# EAGLE design dual.vca.main (EAGLE 7.5.0)
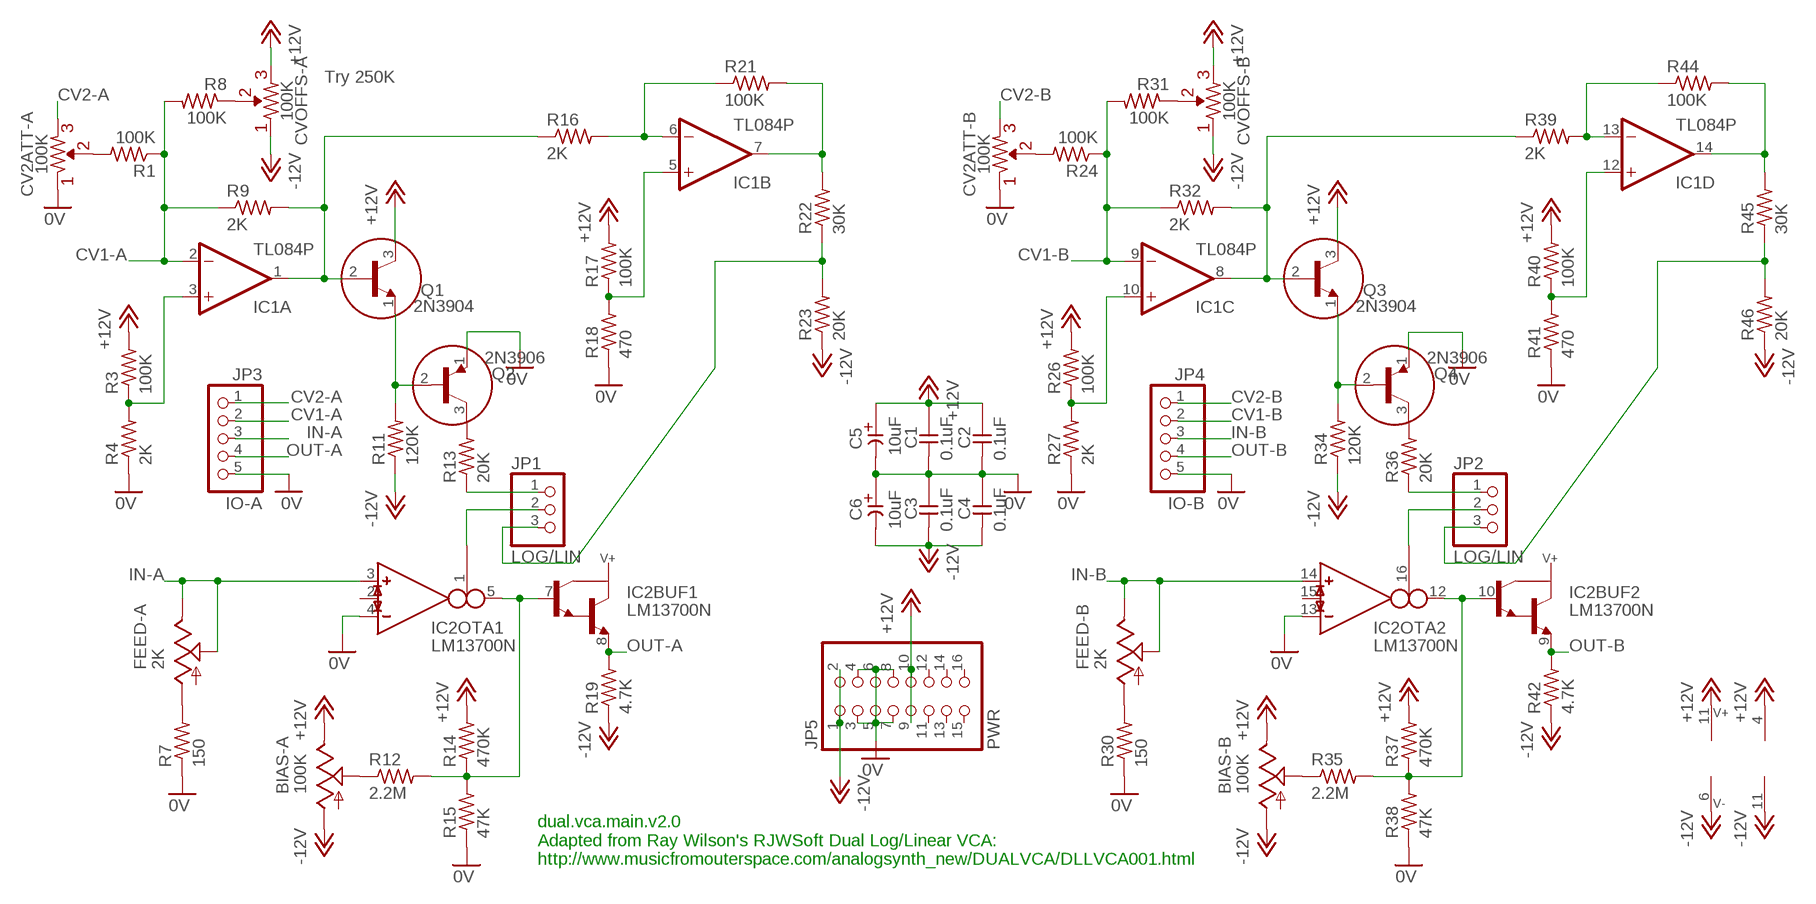
[diagram p0: schematic, sheet 1]

## Parts
BIAS-A  100K  TRIM_US-PT10S  [PT-10S]
BIAS-B  100K  TRIM_US-PT10S  [PT-10S]
C1  0.1uF  CC-US025-024X044  [C025-024X044]
C2  0.1uF  CC-US025-024X044  [C025-024X044]
C3  0.1uF  CC-US025-024X044  [C025-024X044]
C4  0.1uF  CC-US025-024X044  [C025-024X044]
C5  10uF  CE-USE2-5  [E2-5]
C6  10uF  CE-USE2-5  [E2-5]
CV2ATT-A  100K  R-VAR  [R-VAR]
CV2ATT-B  100K  R-VAR  [R-VAR]
CVOFFS-A  100K  R-VAR  [R-VAR]
CVOFFS-B  100K  R-VAR  [R-VAR]
FEED-A  2K  TRIM_US-PT10S  [PT-10S]
FEED-B  2K  TRIM_US-PT10S  [PT-10S]
IC1  TL084P  [DIL14]
IC2  LM13700N  [DIL16]
JP1  LOG/LIN  PINHD-1X3  [1X03]
JP2  LOG/LIN  PINHD-1X3  [1X03]
JP3  IO-A  PINHD-1X5  [1X05]
JP4  IO-B  PINHD-1X5  [1X05]
JP5  PWR  PINHD-2X8  [2X08]
Q1  2N3904  [TO92]
Q2  2N3906  [TO92]
Q3  2N3904  [TO92]
Q4  2N3906  [TO92]
R1  100K  R-US_0207/7  [0207/7]
R3  100K  R-US_0207/7  [0207/7]
R4  2K  R-US_0207/7  [0207/7]
R7  150  R-US_0207/7  [0207/7]
R8  100K  R-US_0207/7  [0207/7]
R9  2K  R-US_0207/7  [0207/7]
R11  120K  R-US_0207/7  [0207/7]
R12  2.2M  R-US_0207/7  [0207/7]
R13  20K  R-US_0207/7  [0207/7]
R14  470K  R-US_0207/7  [0207/7]
R15  47K  R-US_0207/7  [0207/7]
R16  2K  R-US_0207/7  [0207/7]
R17  100K  R-US_0207/7  [0207/7]
R18  470  R-US_0207/7  [0207/7]
R19  4.7K  R-US_0207/7  [0207/7]
R21  100K  R-US_0207/7  [0207/7]
R22  30K  R-US_0207/7  [0207/7]
R23  20K  R-US_0207/7  [0207/7]
R24  100K  R-US_0207/7  [0207/7]
R26  100K  R-US_0207/7  [0207/7]
R27  2K  R-US_0207/7  [0207/7]
R30  150  R-US_0207/7  [0207/7]
R31  100K  R-US_0207/7  [0207/7]
R32  2K  R-US_0207/7  [0207/7]
R34  120K  R-US_0207/7  [0207/7]
R35  2.2M  R-US_0207/7  [0207/7]
R36  20K  R-US_0207/7  [0207/7]
R37  470K  R-US_0207/7  [0207/7]
R38  47K  R-US_0207/7  [0207/7]
R39  2K  R-US_0207/7  [0207/7]
R40  100K  R-US_0207/7  [0207/7]
R41  470  R-US_0207/7  [0207/7]
R42  4.7K  R-US_0207/7  [0207/7]
R44  100K  R-US_0207/7  [0207/7]
R45  30K  R-US_0207/7  [0207/7]
R46  20K  R-US_0207/7  [0207/7]

## Nets
0V: C1.2 C2.2 C3.1 C4.1 C5.- C6.+ CV2ATT-A.R1 CV2ATT-B.R1 IC2.4(OTA1:IN_N) IC2.13(OTA2:IN_N) JP3.5 JP4.5 JP5.3 JP5.4 JP5.5 JP5.6 JP5.7 JP5.8 Q2.1(E) Q4.1(E) R4.1 R7.1 R15.1 R18.1 R27.1 R30.1 R38.1 R41.1
+12V: BIAS-A.E BIAS-B.E C1.1 C2.1 C5.+ CVOFFS-A.R2 CVOFFS-B.R2 IC1.4(P:V+) IC2.11(SUPPLY:V+) JP5.9 JP5.10 Q1.3(C) Q3.3(C) R3.2 R14.2 R17.2 R26.2 R37.2 R40.2
-12V: BIAS-A.A BIAS-B.A C3.2 C4.2 C6.- CVOFFS-A.R1 CVOFFS-B.R1 IC1.11(P:V-) IC2.6(SUPPLY:V-) JP5.1 JP5.2 R11.1 R19.1 R23.1 R34.1 R42.1 R46.1
CV1-A: IC1.2(A:-IN) JP3.2 R1.1 R8.2 R9.1
CV1-B: IC1.9(C:-IN) JP4.2 R24.1 R31.2 R32.1
CV2-A: CV2ATT-A.R2 JP3.1
CV2-B: CV2ATT-B.R2 JP4.1
IN-A: FEED-A.E FEED-A.S IC2.3(OTA1:IN_P) JP3.3
IN-B: FEED-B.E FEED-B.S IC2.14(OTA2:IN_P) JP4.3
N$1: Q2.3(C) R13.2
N$2: Q4.3(C) R36.2
N$3: IC1.3(A:+IN) R3.1 R4.2
N$5: CVOFFS-A.VAR R8.1
N$6: IC1.1(A:OUT) Q1.2(B) R9.2 R16.1
N$7: Q1.1(E) Q2.2(B) R11.2
N$8: FEED-A.A R7.2
N$10: JP1.1 R13.1
N$14: BIAS-A.S R12.1
N$15: IC2.5(OTA1:OUT) IC2.7(BUF1:B) R12.2 R14.1 R15.2
N$17: CV2ATT-A.VAR R1.2
N$18: JP1.3 R22.1 R23.2
N$19: IC1.5(B:+IN) R17.1 R18.2
N$20: IC1.6(B:-IN) R16.2 R21.1
N$21: IC2.1(OTA1:I_BIAS) JP1.2
N$22: IC1.7(B:OUT) R21.2 R22.2
N$25: IC1.10(C:+IN) R26.1 R27.2
N$27: CVOFFS-B.VAR R31.1
N$28: IC1.8(C:OUT) Q3.2(B) R32.2 R39.1
N$29: Q3.1(E) Q4.2(B) R34.2
N$31: FEED-B.A R30.2
N$34: BIAS-B.S R35.1
N$35: IC2.10(BUF2:B) IC2.12(OTA2:OUT) R35.2 R37.1 R38.2
N$38: CV2ATT-B.VAR R24.2
N$39: IC1.12(D:+IN) R40.1 R41.2
N$40: IC1.13(D:-IN) R39.2 R44.1
N$41: IC1.14(D:OUT) R44.2 R45.2
N$42: JP2.1 R36.1
N$43: JP2.3 R45.1 R46.2
N$44: IC2.16(OTA2:I_BIAS) JP2.2
OUT-A: IC2.8(BUF1:E) JP3.4 R19.2
OUT-B: IC2.9(BUF2:E) JP4.4 R42.2
Unconnected: IC2.2(OTA1:I_DIODE) IC2.15(OTA2:I_DIODE) JP5.11 JP5.12 JP5.13 JP5.14 JP5.15 JP5.16

## Notes on the sheet
- Try 250K
- dual.vca.main.v2.0
  Adapted from Ray Wilson's RJWSoft Dual Log/Linear VCA:
  http://www.musicfromouterspace.com/analogsynth_new/DUALVCA/DLLVCA001.html

## Library data of the parts
BIAS-A BIAS-B FEED-A FEED-B = pot:TRIM_US-: POTENTIOMETER
C1-C4 = _common:CC-US: CAPACITOR, US symbol
C5 C6 = _common:CE-US: ELECTROLYTIC CAPACITOR, US symbol
CV2ATT-A CV2ATT-B CVOFFS-A CVOFFS-B = _common:R-VAR
IC1 = linear:TL084: OP AMP
IC2 = ota:LM13700: Dual OTA with buffers
JP1 JP2 = pinhead:PINHD-1X3: PIN HEADER
JP3 JP4 = pinhead:PINHD-1X5: PIN HEADER
JP5 = pinhead:PINHD-2X8: PIN HEADER
Q1 Q3 = _common:2N3904
Q2 Q4 = _common:2N3906: PNP Transistor
R1 R3 R4 R7-R9 R11-R19 R21-R24 R26 R27 R30-R32 R34-R42 R44-R46 = resistor:R-US_: RESISTOR, American symbol

## Board
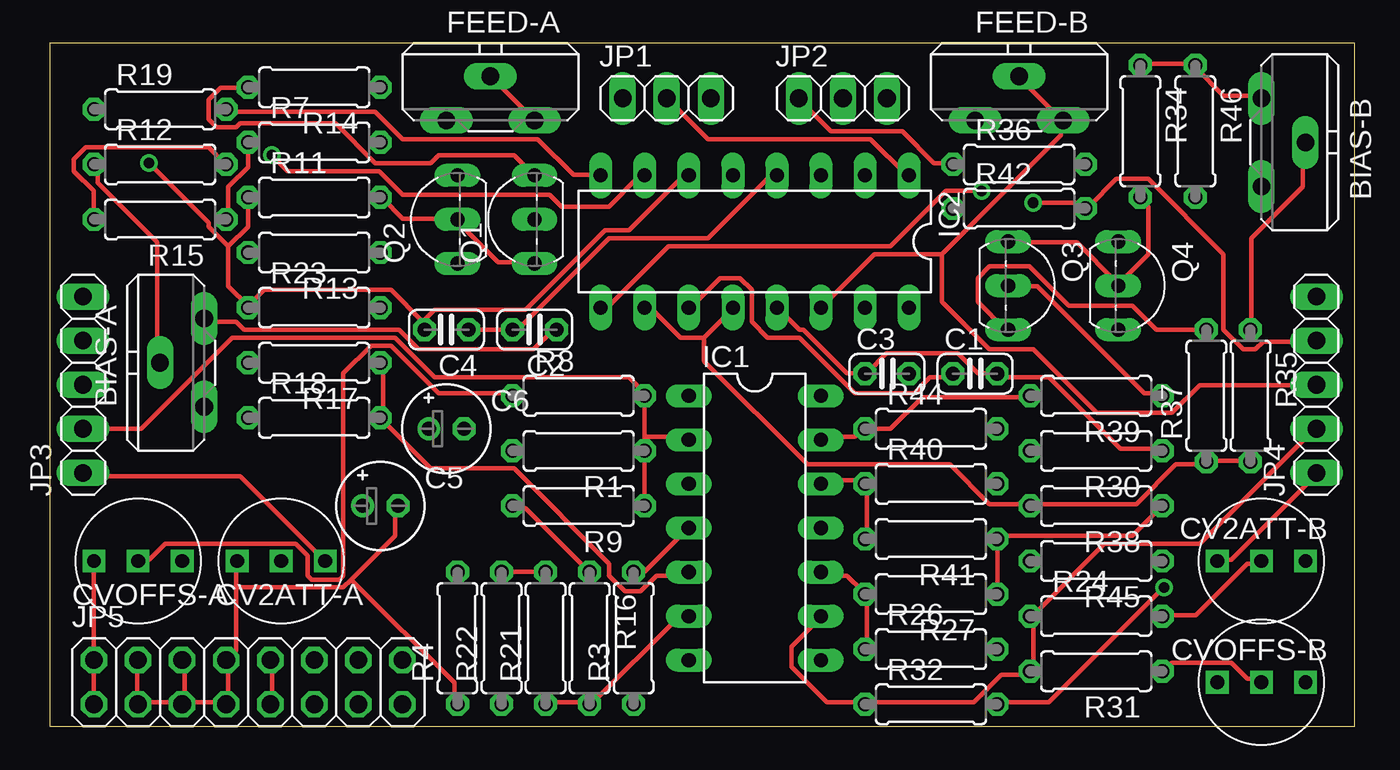
[diagram p1: board, top side]
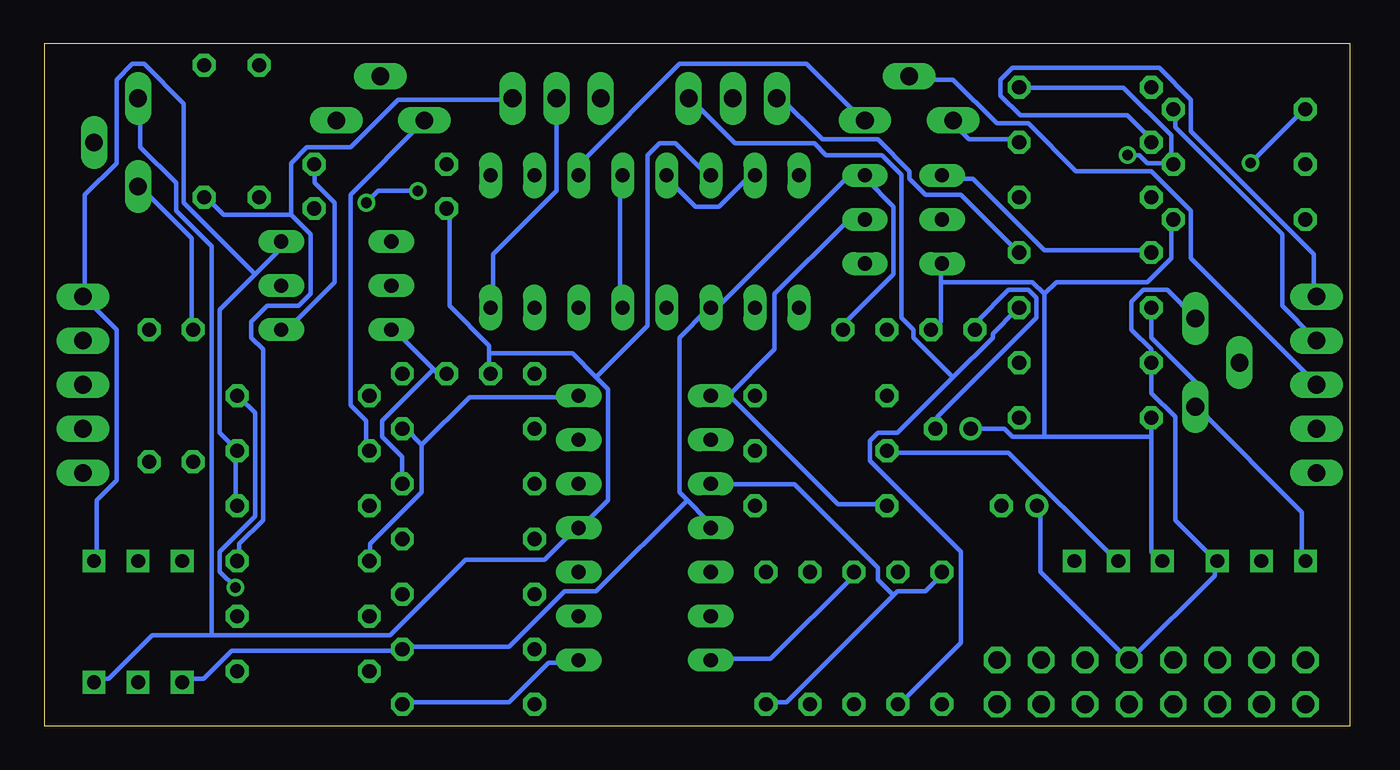
[diagram p2: board, bottom side, seen from below]

Size 75.23 x 39.36 mm. Coordinates in mm from the lower left corner, seen from the top.
Outline: 0,0 75.23,0 75.23,39.36 0,39.36 0,0
Copper layers (1*16): Top 0.035mm / dielectric 1.5mm / Bottom 0.035mm
Design rules "default": minimum track width 10mil, minimum drill 24mil, track to track 8mil, track to pad 8mil, pad to pad 8mil, via to via 8mil, smd to smd 8mil, copper to edge 40mil, drill to drill 8mil, minimum pad ring 10mil, minimum via ring 8mil, stop-mask expansion 4mil, vias tented up to drill 0mil, thermal gap 10mil

### Footprints (pad centres in the part's own frame; a part is rotated, then mirrored left to right if it is on the bottom)
PT-10S = drill 1.016 long: A -2.54,-1.27; E 2.54,-1.27; S 0,1.27
C025-024X044 = drill 0.813 octagon: 1 -1.27,0; 2 1.27,0
E2-5 = drill 0.813 pad 1.27: + -1.016,0 | drill 0.813 pad 1.27 octagon: - 1.016,0
R-VAR = drill 0.8 square: R1 -2.54,0; R2 2.54,0; VAR 0,0
DIL14 = drill 0.813 long: 1 -7.62,-3.81; 2 -5.08,-3.81; 3 -2.54,-3.81; 4 0,-3.81; 5 2.54,-3.81; 6 5.08,-3.81; 7 7.62,-3.81; 8 7.62,3.81; 9 5.08,3.81; 10 2.54,3.81; 11 0,3.81; 12 -2.54,3.81; 13 -5.08,3.81; 14 -7.62,3.81
DIL16 = drill 0.813 long: 1 -8.89,-3.81; 2 -6.35,-3.81; 3 -3.81,-3.81; 4 -1.27,-3.81; 5 1.27,-3.81; 6 3.81,-3.81; 7 6.35,-3.81; 8 8.89,-3.81; 9 8.89,3.81; 10 6.35,3.81; 11 3.81,3.81; 12 1.27,3.81; 13 -1.27,3.81; 14 -3.81,3.81; 15 -6.35,3.81; 16 -8.89,3.81
1X03 = drill 1.016 long: 1 -2.54,0; 2 0,0; 3 2.54,0
1X05 = drill 1.016 long: 1 -5.08,0; 2 -2.54,0; 3 0,0; 4 2.54,0; 5 5.08,0
2X08 = drill 1.016 octagon: 1 -8.89,-1.27; 2 -8.89,1.27; 3 -6.35,-1.27; 4 -6.35,1.27; 5 -3.81,-1.27; 6 -3.81,1.27; 7 -1.27,-1.27; 8 -1.27,1.27; 9 1.27,-1.27; 10 1.27,1.27; 11 3.81,-1.27; 12 3.81,1.27; 13 6.35,-1.27; 14 6.35,1.27; 15 8.89,-1.27; 16 8.89,1.27
TO92 = drill 0.813 long: 1 -2.54,-1.27; 2 0,-1.27; 3 2.54,-1.27
0207/7 = drill 0.813 octagon: 1 -3.81,0; 2 3.81,0

### Placement (x,y rotation side)
BIAS-A  7.62,20.95 90 top
BIAS-B  71.12,33.66 270 top
C1  53.34,20.32 0 top
C2  27.94,22.86 180 top
C3  48.26,20.32 0 top
C4  22.86,22.86 180 top
C5  19.05,12.7 0 top
C6  22.86,17.14 0 top
CV2ATT-A  13.34,9.53 0 top
CV2ATT-B  69.85,9.53 180 top
CVOFFS-A  5.08,9.53 0 top
CVOFFS-B  69.85,2.54 180 top
FEED-A  25.4,36.2 0 top
FEED-B  55.88,36.2 0 top
IC1  40.64,11.43 270 top
IC2  40.64,27.94 180 top
JP1  35.56,36.2 0 top
JP2  45.72,36.2 0 top
JP3  1.91,19.68 90 top
JP4  73.03,19.68 90 top
JP5  11.43,2.54 0 top
Q1  26.67,29.21 90 top
Q2  22.23,29.21 90 top
Q3  56.52,25.4 270 top
Q4  62.87,25.4 270 top
R1  30.48,15.88 180 top
R3  33.66,5.08 90 top
R4  23.5,5.08 90 top
R7  15.24,33.66 0 top
R8  30.48,19.05 0 top
R9  30.48,12.7 180 top
R11  15.24,30.48 0 top
R12  6.35,32.38 0 top
R13  15.24,27.3 180 top
R14  15.24,36.83 180 top
R15  6.35,29.21 180 top
R16  31.11,5.08 270 top
R17  15.24,20.95 180 top
R18  15.24,17.78 0 top
R19  6.35,35.56 0 top
R21  28.57,5.08 90 top
R22  26.04,5.08 90 top
R23  15.24,24.13 0 top
R24  60.33,6.35 0 top
R26  50.8,4.45 0 top
R27  50.8,7.62 180 top
R30  60.33,15.88 180 top
R31  60.33,3.17 180 top
R32  50.8,1.27 0 top
R34  62.87,34.29 270 top
R35  69.22,19.05 270 top
R36  55.88,32.38 0 top
R37  66.67,19.05 90 top
R38  60.33,12.7 180 top
R39  60.33,19.05 180 top
R40  50.8,13.97 0 top
R41  50.8,10.79 180 top
R42  55.88,29.84 0 top
R44  50.8,17.14 0 top
R45  60.33,9.53 180 top
R46  66.04,34.29 270 top

### Tracks (layer width: path | path; a pad name or v marks a point on that pad's centre or on a via)
0V
  Top 0.254: IC2.13 42.06,24 43.2,22.86 43.43,22.86 45.95,20.34 46.86,20.34 C3.1 47.09,20.34 48.23,21.49 52.35,21.49 53.49,20.34 54.41,20.34 C1.2 54.63,20.12 57.61,20.12 61.72,16 64.01,16 R30.1 | R27.1 54.63,7.77 54.63,10.74 R41.1 54.63,10.97 62.41,10.97 R38.1 | R7.1 11.43,32.23 10.29,31.09 10.29,29.26 R15.1 | C4.1 C2.2 26.98,22.86 32.23,28.12 37.95,28.12 41.38,31.55 41.83,31.55 IC2.4 | JP5.4 5.03,3.66 5.03,1.37 JP5.3 5.26,1.37 7.54,1.37 JP5.5 7.77,1.37 | 7.77,1.37 7.77,3.66 JP5.6 | 10.74,8 10.74,4.34 10.29,3.89 JP5.8 10.29,3.66 10.29,1.37 JP5.7 10.06,1.37 7.77,1.37 | 10.74,8 10.74,9.37 CV2ATT-A.R1 | 17.37,8.46 16.92,8 10.74,8 | 17.37,8.46 19.89,10.97 19.89,12.57 C5.- | 17.37,8.46 23.32,2.52 23.32,1.37 R4.1
  Bottom 0.254: IC2.4 42.06,31.55 42.06,24.23 IC2.13 | CV2ATT-B.R1 72.24,9.6 72.24,13.03 71.09,14.17 71.09,22.86 72.92,24.69 JP4.5 72.92,24.92 72.92,30.63 71.09,32.46 71.09,37.26 70.18,38.18 69.49,38.18 67.21,35.89 67.21,30.18 63.09,26.06 | R38.1 64.24,12.8 64.24,15.77 R30.1 64.24,16 65.15,16.92 65.15,24 63.09,26.06 | 63.09,26.06 61.72,27.43 61.72,27.89 Q4.1 | JP3.5 2.06,24.92 2.06,27.2 9.14,34.29 9.14,36.12 10.97,37.95 19.43,37.95 20.12,37.26 20.12,36.35 18.97,35.2 12.8,35.2 11.43,33.83 R7.1 | 23.55,25.6 23.55,23.32 24,22.86 C4.1 | 23.55,25.6 23.55,26.52 Q2.1 | 11.43,16.69 11.43,10.06 10.97,9.6 CV2ATT-A.R1 | 11.43,16.69 R18.1 | C6.+ 19.89,17.14 19.43,16.69 17.6,16.69 | 11.43,16.69 17.6,16.69 | 23.55,25.6 18.29,25.6 17.6,24.92 | 17.6,16.69 17.6,24.92 | 17.6,24.92 16.92,25.6 11.66,25.6 10.29,26.98 10.29,29.03 R15.1
+12V
  Top 0.254: R37.2 63.78,22.86 62.41,24.23 58.75,24.23 56.46,26.52 54.18,26.52 53.49,25.83 53.49,24.46 55.09,22.86 Q3.3 | JP5.9 12.8,1.37 12.8,3.66 JP5.10 | R3.2 33.83,8.91 34.29,8.91 36.8,11.43 IC1.4 | R14.2 11.43,36.8 9.83,36.8 9.14,36.12 9.14,34.98 9.6,34.52 10.74,34.52 10.97,34.75 16.46,34.75 18.75,32.46 21.95,32.46 22.4,32.92 26.75,32.92 27.89,31.77 Q1.3 | BIAS-A.E 8.91,23.32 10.74,23.32 11.2,22.86 20.12,22.86 21.26,21.72 27.89,21.72 29.03,22.86 C2.1 | C1.1 51.89,20.12 50.75,20.12 49.84,19.2 46.41,19.2 43.2,22.4 41.38,22.4 40.46,23.32 40.46,25.15 39.78,25.83 38.63,25.83 37.03,24.23 IC2.11
  Bottom 0.254: R37.2 66.75,22.86 66.75,28.12 69.72,31.09 BIAS-B.E | 52.81,20.57 55.09,22.86 Q3.3 | 52.81,20.57 52.58,20.34 52.12,20.34 C1.1 | 52.81,20.57 55.78,17.6 55.78,16.69 54.63,15.54 54.63,14.17 R40.2 | BIAS-A.E 8.91,23.55 10.52,25.15 11.89,25.15 12.57,24.46 12.57,22.86 11.43,21.72 R17.2 11.43,19.2 10.06,17.83 10.06,11.89 7.77,9.6 CVOFFS-A.R2 7.77,9.37 7.77,8.69 12.57,3.89 JP5.10 12.8,3.89 17.83,8.91 17.83,12.57 C5.+ | CVOFFS-B.R2 67.21,2.74 66.06,2.74 64.47,4.34 54.63,4.34 R26.2 54.41,4.57 48.46,4.57 45.26,7.77 43.43,7.77 38.18,13.03 | C2.1 29.03,22.86 29.03,23.32 26.29,26.06 26.29,29.95 27.89,31.55 Q1.3 28.12,31.55 29.03,31.55 36.35,24.23 36.8,24.23 IC2.11 37.03,24 38.63,22.4 38.63,13.49 38.18,13.03 | 38.18,13.03 37.03,11.89 37.03,11.43 IC1.4
-12V  (via drill 0.61)
  Top 0.254: R34.1 62.87,38.18 65.84,38.18 R46.1 66.06,37.95 67.67,36.35 69.72,36.35 BIAS-B.A | CVOFFS-A.R1 2.52,9.37 2.52,3.89 JP5.2 2.52,3.66 2.52,1.37 JP5.1 | R11.1 11.43,28.8 10.29,27.66 | 10.29,27.66 10.29,25.38 11.43,24.23 | v5.71,32.46 9.14,29.03 9.14,28.8 10.29,27.66 | 21.49,23.32 21.49,22.86 C4.2 21.49,23.32 | 21.49,23.32 19.66,25.15 12.34,25.15 11.43,24.23 | 11.43,24.23 R23.1 | 21.49,23.32 22.17,24 27.43,24 32,28.57 33.38,28.57 36.35,31.55 36.8,31.55 IC2.6
  Bottom 0.254: 49.61,21.49 49.61,21.95 51.89,24.23 51.89,29.72 R42.1 | 49.61,21.49 49.61,20.34 C3.2 | 65.61,5.26 55.32,5.26 50.98,9.6 46.41,9.6 44.58,11.43 IC1.11 44.35,11.43 42.75,13.03 42.75,19.43 43.43,20.12 | 65.61,5.26 69.04,5.26 71.55,2.74 72.24,2.74 CVOFFS-B.R1 | 65.61,5.26 65.61,27.66 67.67,29.72 67.67,31.32 69.72,33.38 69.72,36.12 BIAS-B.A | 49.61,21.49 44.81,21.49 43.43,20.12 | R23.1 11.43,22.4 8.91,19.89 8.91,18.52 BIAS-A.A 8.69,18.29 2.74,12.34 2.74,9.6 CVOFFS-A.R1 | v5.71,32.46 2.74,35.43 R19.1 | C6.- 23.77,17.14 23.77,17.83 18.06,23.55 18.06,24.69 18.52,25.15 19.66,25.15 21.49,23.32 21.49,22.86 C4.2 | 43.43,20.12 40.46,23.09 40.46,32.92 39.78,33.6 38.86,33.6 37.03,31.77 IC2.6
CV1-A
  Top 0.254: R9.1 R1.1 34.29,16.69 | 34.29,16.69 R8.2 34.29,19.2 33.38,20.12 22.17,20.12 19.89,22.4 10.52,22.4 5.26,17.14 JP3.2 | 34.29,16.69 36.8,16.69 IC1.2
CV1-B
  Top 0.254: IC1.9 44.35,6.17 42.75,4.57 42.75,3.43 44.81,1.37 46.86,1.37 R32.1 47.09,1.37 53.26,1.37 54.86,2.97 56.46,2.97 R31.2 56.69,3.2 56.69,6.17 R24.1 56.69,6.4 60.81,10.52 66.29,10.52 72.92,17.14 JP4.2
CV2-A
  Top 0.254: CV2ATT-A.R2 15.77,9.6 10.97,14.4 2.06,14.4 JP3.1
CV2-B
  Top 0.254: CV2ATT-B.R2 67.44,9.6 68.12,9.6 72.92,14.4 JP4.1
IN-A
  Top 0.254: FEED-A.S FEED-A.E
  Bottom 0.254: IC2.3 44.35,31.77 44.35,32.46 38.63,38.18 31.32,38.18 28.12,34.98 FEED-A.E | JP3.3 2.06,19.89 9.14,26.98 9.14,29.72 11.43,32 15.77,32 18.52,34.75 20.34,34.75 22.86,37.26 25.38,37.26 FEED-A.S
IN-B
  Top 0.254: 51.44,27.2 47.55,27.2 44.58,24.23 IC2.14 | 51.44,27.2 58.29,34.06 58.29,34.75 FEED-B.E 58.29,34.98 56.01,37.26 FEED-B.S | 51.44,27.2 51.44,24.46 54.18,21.72 56.69,21.72 60.35,18.06 64.69,18.06 66.29,19.66 72.92,19.66 JP4.3
N$1
  Bottom 0.254: R13.2 11.43,27.43 17.6,27.43 21.72,31.55 23.32,31.55 Q2.3
N$2
  Bottom 0.254: Q4.3 61.27,22.86 58.52,25.6 58.52,30.18 59.66,31.32 59.66,32.23 R36.2
N$3
  Bottom 0.254: 26.29,7.54 26.06,7.77 24.46,7.77 23.55,8.69 R4.2 | 26.29,7.54 32.46,1.37 33.6,1.37 R3.1 | 26.29,7.54 27.2,8.46 27.2,9.14 32,13.95 36.8,13.95 IC1.3
N$5
  Top 0.254: CVOFFS-A.VAR 5.26,9.6 5.71,9.6 6.63,10.52 14.17,10.52 14.86,9.83 14.86,8.69 15.09,8.46 16.69,8.46 16.92,8.69 16.92,20.34 18.52,21.95 19.66,21.95 22.4,19.2 26.52,19.2 R8.1
N$6
  Top 0.254: R16.1 27.43,12.57 26.75,12.57 R9.2
  Bottom 0.254: 35.89,18.97 35.66,18.97 29.49,12.8 26.75,12.8 R9.2 | 35.89,18.97 36.8,18.97 IC1.1 35.89,18.97 | 35.89,18.97 33.15,21.72 33.15,24.92 29.03,29.03 28.12,29.03 Q1.2
N$7
  Top 0.254: R11.2 19.2,30.4 20.34,29.26 23.32,29.26 Q2.2 23.55,29.03 25.83,26.75 27.89,26.75 Q1.1
N$8
  Bottom 0.254: R7.2 19.2,33.83 21.95,33.83 22.86,34.75 FEED-A.A
N$10
  Bottom 0.254: R13.1 19.2,27.43 22.4,30.63 24.46,30.63 25.38,31.55 25.38,32 27.2,33.83 30.4,33.83 32.92,36.35 JP1.1
N$14
  Top 0.254: R12.1 2.74,32.23 2.74,31.32 6.17,27.89 6.17,21.03 BIAS-A.S
N$15  (via drill 0.61)
  Top 0.254: R15.2 2.52,29.26 2.52,30.86 1.37,32 1.37,32.69 2.06,33.38 9.14,33.38 10.06,32.46 R12.2 | v12.8,32.92 13.72,32 18.97,32 20.34,30.63 28.8,30.63 29.49,29.95 32.23,29.95 33.83,31.55 34.29,31.55 IC2.7
  Bottom 0.254: IC2.7 34.29,31.55 34.75,31.55 36.35,29.95 37.72,29.95 39.32,31.55 IC2.5 | 10.29,32.46 10.29,34.06 13.03,36.8 18.97,36.8 R14.1 | v12.8,32.92 12.12,32.92 11.66,32.46 10.29,32.46 | 10.29,32.46 R12.2
N$17
  Bottom 0.254: CV2ATT-A.VAR 13.49,9.6 19.66,15.77 26.52,15.77 R1.2
N$18
  Bottom 0.254: 22.86,20.12 26.06,16.92 27.2,16.92 27.66,16.46 27.66,15.32 22.4,10.06 22.4,4.8 25.83,1.37 R22.1 | 22.86,20.12 20.57,22.4 20.57,22.63 19.2,24 R23.2 | 22.86,20.12 25.15,22.4 25.15,22.86 25.83,23.55 25.83,31.77 26.98,32.92 30.18,32.92 30.86,33.6 35.43,33.6 37.95,36.12 JP1.3
N$19
  Top 0.254: R17.1 19.2,20.8 19.2,17.83 R18.2 19.2,17.6 21.95,14.86 26.75,14.86 32.23,9.37 32.23,8.69 33.15,7.77 34.06,7.77 34.98,8.69 36.8,8.69 IC1.5
N$20
  Top 0.254: R21.1 28.57,1.37 31.09,1.37 R16.2 31.32,1.37 36.12,6.17 36.8,6.17 IC1.6
N$21
  Top 0.254: IC2.1 49.38,31.77 47.32,33.83 37.95,33.83 35.66,36.12 JP1.2
N$22
  Top 0.254: R22.2 26.06,8.91 28.57,8.91 R21.2
  Bottom 0.254: IC1.7 36.8,3.89 33.38,3.89 28.57,8.69 R21.2
N$25
  Top 0.254: IC1.10 44.58,8.69 45.95,8.69 46.86,7.77 R27.2 47.09,7.54 47.09,4.57 R26.1
N$27
  Top 0.254: CVOFFS-B.VAR 69.72,2.74 69.04,2.74 68.12,3.66 64.69,3.66 64.24,3.2 R31.1
N$28  (via drill 0.61)
  Top 0.254: Q3.2 55.32,25.38 56.92,25.38 63.09,19.2 64.01,19.2 R39.1 | v64.24,8 57.61,1.37 54.63,1.37 R32.2
  Bottom 0.254: IC1.8 44.58,3.66 46.18,3.66 48.46,1.37 54.41,1.37 R32.2 | v64.24,8 65.15,8.91 65.15,10.06 63.09,12.12 63.09,18.06 64.01,18.97 R39.1
N$29
  Top 0.254: R34.2 62.87,30.4 63.32,29.95 63.32,27.2 61.72,25.6 Q4.2 61.49,25.6 59.21,27.89 55.32,27.89 Q3.1
N$31
  Bottom 0.254: R30.2 56.69,16 56.69,17.6 57.61,18.52 57.61,30.63 53.49,34.75 FEED-B.A
N$34
  Top 0.254: R35.1 69.27,22.86 69.27,28.12 72.24,31.09 72.24,33.6 BIAS-B.S
N$35
  Top 0.254: 37.72,22.4 36.35,22.4 34.75,24 34.29,24 IC2.10 | 37.72,22.4 39.32,24 IC2.12 | R35.2 69.04,15.32 66.75,15.32 R37.1 66.52,15.09 64.92,15.09 62.64,12.8 56.69,12.8 R38.2 56.46,12.8 54.18,12.8 51.89,15.09 43.66,15.09 37.72,21.03 37.72,22.4
N$38
  Top 0.254: CV2ATT-B.VAR 69.72,9.37 69.04,9.37 66.06,6.4 64.24,6.4 R24.2
N$39
  Top 0.254: R41.2 47.09,10.97 47.09,13.95 R40.1 46.86,14.17 44.58,14.17 IC1.12
N$40
  Top 0.254: IC1.13 44.58,16.69 46.41,16.69 46.86,17.14 R44.1 48.46,17.14 50.29,18.97 56.46,18.97 R39.2
N$41
  Bottom 0.254: 53.49,16.23 53.49,13.49 56.46,10.52 56.46,9.6 R45.2 | 53.49,16.23 54.41,17.14 R44.2 | 53.49,16.23 50.75,18.97 44.58,18.97 IC1.14
N$42
  Top 0.254: R36.1 51.89,32.46 50.98,32.46 49.15,34.29 45.03,34.29 43.2,36.12 JP2.1
N$43
  Bottom 0.254: 61.04,29.49 59.89,28.35 59.89,24.92 60.58,24.23 62.41,24.23 63.32,23.32 63.32,22.4 62.64,21.72 62.64,11.89 64.01,10.52 64.01,9.6 R45.1 | 61.04,29.49 64.92,29.49 65.84,30.4 R46.2 | 61.04,29.49 61.04,32.46 60.12,33.38 57.61,33.38 54.86,36.12 48.46,36.12 JP2.3
N$44
  Bottom 0.254: JP2.2 45.72,30.86 49.38,27.2 49.38,24.23 IC2.16
OUT-A
  Top 0.254: IC2.8 31.55,31.77 30.18,31.77 28.12,33.83 20.34,33.83 18.75,35.43 10.29,35.43 R19.2
  Bottom 0.254: R19.2 10.06,35.43 10.06,34.52 3.89,28.35 3.89,24.23 2.06,22.4 JP3.4
OUT-B  (via drill 0.61)
  Top 0.254: v53.72,30.86 51.66,30.86 48.46,27.66 35.66,27.66 32.23,24.23 31.77,24.23 IC2.9 | v56.69,30.18 59.44,30.18 59.66,29.95 R42.2 59.89,29.95 61.49,31.55 63.32,31.55 67.67,27.2 67.67,22.86 68.81,21.72 69.49,21.72 69.95,22.17 72.92,22.17 JP4.4
  Bottom 0.254: v53.72,30.86 56.01,30.86 v56.69,30.18